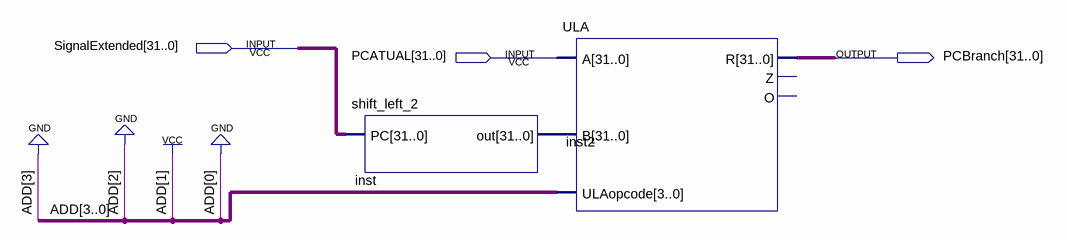
[diagram p0: schematic sheet]
// Quartus schematic PCBranch.bdf as structural Verilog: 2 symbols, 3 pins
module PCBranch (
  input  [31:0] SignalExtended,
  input  [31:0] PCATUAL,
  output [31:0] PCBranch
);

  wire [31:0] inst_out;

  shift_left_2 inst (.PC(SignalExtended), .out(inst_out));
  ULA inst2 (.ULAopcode(4'b0010), .A(PCATUAL), .B(inst_out), .R(PCBranch));  // open: Z, O
endmodule
